# EAGLE design IoT_Shield (EAGLE 7.3.0)
Version 1.1
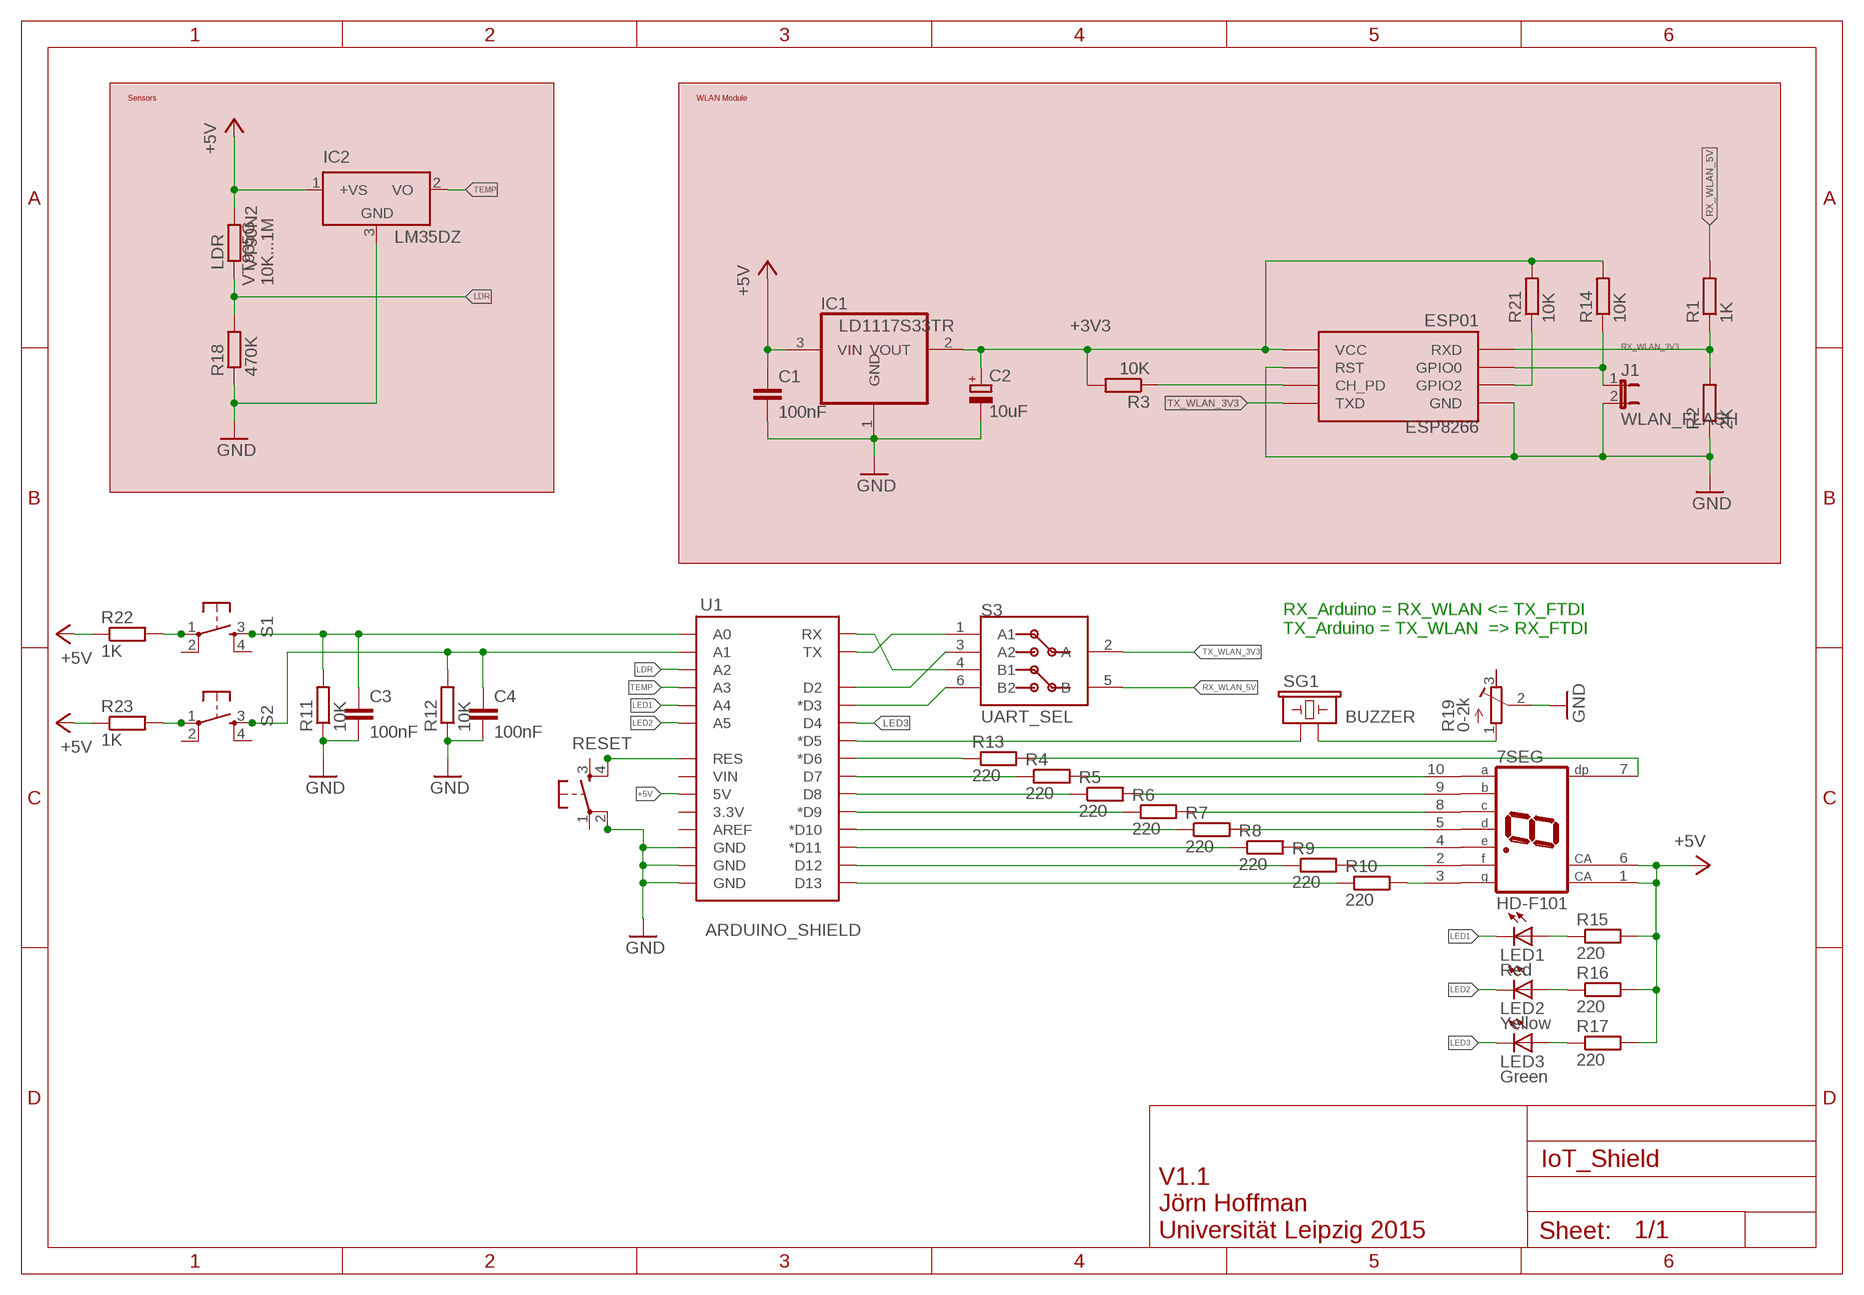
[diagram p0: schematic, sheet 1]

## Parts
7SEG  HD-F101  [HDSP-E]
C1  100nF  C-EUC0805  [C0805]
C2  10uF  CPOL-EUA/3216-18R  [A/3216-18R]
C3  100nF  C-EUC0805  [C0805]
C4  100nF  C-EUC0805  [C0805]
ESP8266  ESP01  [ESP01]
IC1  LD1117S33TR  REG1117  [SOT223]
IC2  LM35DZ  LM35CZ  [TO92]
J1  WLAN_FLASH  JP1E  [JP1]
LDR  VT90N2  R-EU_0204/2V  [0204V]
LED1  Red  LED5MM  [LED5MM]
LED2  Yellow  LED5MM  [LED5MM]
LED3  Green  LED5MM  [LED5MM]
R1  1K  R-EU_R0805  [R0805]
R2  2K  R-EU_R0805  [R0805]
R3  10K  R-EU_R0805  [R0805]
R4  220  R-EU_R0805  [R0805]
R5  220  R-EU_R0805  [R0805]
R6  220  R-EU_R0805  [R0805]
R7  220  R-EU_R0805  [R0805]
R8  220  R-EU_R0805  [R0805]
R9  220  R-EU_R0805  [R0805]
R10  220  R-EU_R0805  [R0805]
R11  10K  R-EU_R0805  [R0805]
R12  10K  R-EU_R0805  [R0805]
R13  220  R-EU_R0805  [R0805]
R14  10K  R-EU_R0805  [R0805]
R15  220  R-EU_R0805  [R0805]
R16  220  R-EU_R0805  [R0805]
R17  220  R-EU_R0805  [R0805]
R18  470K  R-EU_R0805  [R0805]
R19  0-2k  R-TRIMM4G/J  [RTRIM4G/J]
R21  10K  R-EU_R0805  [R0805]
R22  1K  R-EU_R0805  [R0805]
R23  1K  R-EU_R0805  [R0805]
RESET  TAC_SWITCHSMD  DTSM-6  [DTSM-6]
S1  TAC_SWITCHSMD  DTSM-6  [DTSM-6]
S2  TAC_SWITCHSMD  DTSM-6  [DTSM-6]
S3  UART_SEL  JS202011SCQN  [SMD]
SG1  BUZZER  BUZZERPTH  [BUZZER-12MM]
U1  ARDUINO_SHIELD  ARDUINO_SHIELDNO_SILK  [DUEMILANOVE_VIAS]

## Nets
+3V3: C2.+ ESP8266.VCC IC1.2(VOUT) R3.2 R14.2 R21.2
+5V: 7SEG.1(CA) 7SEG.6(CA) C1.1 IC1.3(VIN) IC2.1(+VS) LDR.2 R15.2 R16.2 R17.2 R22.1 R23.1 U1.5V
GND: C1.2 C2.- C3.2 C4.2 ESP8266.GND ESP8266.RST IC1.1(GND) IC2.3(GND) J1.2 R2.1 R11.1 R12.1 R18.1 R19.2(S) RESET.2 U1.GND@0(GND) U1.GND@1(GND) U1.GND@2(GND)
LDR: LDR.1 R18.2 U1.A2
LED1: LED1.K(C) U1.A4
LED2: LED2.K(C) U1.A5
LED3: LED3.K(C) U1.D4
N$1: ESP8266.CH_PD R3.1
N$2: R4.1 U1.D7
N$3: R5.1 U1.D8
N$4: R6.1 U1.D9(*D9)
N$5: R7.1 U1.D10(*D10)
N$6: R8.1 U1.D11(*D11)
N$7: R9.1 U1.D12
N$8: R10.1 U1.D13
N$9: 7SEG.10(A) R4.2
N$10: 7SEG.9(B) R5.2
N$11: 7SEG.8(C) R6.2
N$12: 7SEG.5(D) R7.2
N$13: 7SEG.4(E) R8.2
N$14: 7SEG.2(F) R9.2
N$15: 7SEG.3(G) R10.2
N$16: SG1.+ U1.D5(*D5)
N$17: C3.1 R11.2 S1.3 U1.A0
N$18: C4.1 R12.2 S2.3 U1.A1
N$19: 7SEG.7(DP) R13.2
N$21: R13.1 U1.D6(*D6)
N$22: S3.4(B1) U1.RX
N$23: S3.3(A2) U1.D2
N$24: S3.1(A1) U1.TX
N$25: S3.6(B2) U1.D3(*D3)
N$26: ESP8266.GPIO0 J1.1 R14.1
N$27: LED1.A R15.1
N$28: LED2.A R16.1
N$29: LED3.A R17.1
N$30: RESET.4 U1.RES
N$31: ESP8266.GPIO2 R21.1
N$32: R22.2 S1.1
N$33: R23.2 S2.1
N$34: R19.1(A) SG1.-
RX_WLAN_3V3: ESP8266.RX(RXD) R1.1 R2.2
RX_WLAN_5V: R1.2 S3.5(B)
TEMP: IC2.2(VO) U1.A3
TX_WLAN_3V3: ESP8266.TX(TXD) S3.2(A)
Unconnected: R19.3(E) RESET.1 RESET.3 S1.2 S1.4 S2.2 S2.4 U1.3.3V U1.AREF U1.VIN

## Notes on the sheet
- Sensors | WLAN Module
- VT935G
  10K...1M
- RX_Arduino = RX_WLAN <= TX_FTDI 
  TX_Arduino = TX_WLAN  => RX_FTDI
- V1.1
  Jörn Hoffman
  Universität Leipzig 2015

## Library data of the parts
7SEG = display-hp:HD-F101: LED DISPLAY 1-character 7 segment, decimal point right; OC_FARNELL: unknown; OC_NEWARK: unknown
C1 C3 C4 = rcl:C-EU: CAPACITOR, European symbol
C2 = rcl:CPOL-EU: POLARIZED CAPACITOR, European symbol
ESP8266 = esp8266modules:ESP01: ESP8266 Wifi module 01; OC_FARNELL: unknown
IC1 = burr-brown:REG1117: 800mA and 1A Low Dropout (LDO) Positive Regulator 1.8V, 2.5V, 2.85V, 3.3V, 5V, and Adj; MPN: REG1117; OC_FARNELL: 1097566; OC_NEWARK: 14P6981
IC2 = lm35:LM35: Single-Supply Centigrade Temperature Sensor Vout = (10mV/°C x Temp °C) +5mmmV Source: http://www.national.com/ds/LM/LM35.pdf
J1 = jumper:JP1E: JUMPER
LDR R1-R18 R21-R23 = rcl:R-EU_: RESISTOR, European symbol
LED1-LED3 = led:LED: LED OSRAM: - CHIPLED LG R971, LG N971, LY N971, LG Q971, LY Q971, LO R971, LY R971 LH N974, LH R974 LS Q976, LO Q976, LY Q976 LO Q996 - Hyper CHIPLED LW Q18S LB Q993, LB Q99A, LB R99A - SideLED LS A670, LO A670, LY A670, LG A670, LP A670 LB A673, LV A673, LT A673, LW A673 LH A674 LY A675 LS A676, LA A676, LO A676, LY A676, LW A676 LS A679, LY A679, LG A679 - Hyper Micro SIDELED® LS Y876, LA Y876, LO Y876, LY Y876 LT Y87S - SmartLED LW L88C, LW L88S LB L89C, LB L89S, LG L890 LS L89K, LO L89K, LY L89K LS L896, LA L896, LO L896, LY L896 - TOPLED LS T670, LO T670, LY T670, LG T670, LP T670 LSG T670, LSP T670, LSY T670, LOP T670, LYG T670 LG T671, LOG T671, LSG T671 LB T673, LV T673, LT T673, LW T673 LH T674 LS T676, LA T676, LO T676, LY T676, LB T676, LH T676, LSB T676, LW T676 LB T67C, LV T67C, LT T67C, LS T67K, LO T67K, LY T67K, LW E67C LS E67B, LA E67B, LO E67B, LY E67B, LB E67C, LV E67C, LT E67C LW T67C LS T679, LY T679, LG T679 LS T770, LO T770, LY T770, LG T770, LP T770 LB T773, LV T773, LT T773, LW T773 LH T774 LS E675, LA E675, LY E675, LS T675 LS T776, LA T776, LO T776, LY T776, LB T776 LHGB T686 LT T68C, LB T68C - Hyper Mini TOPLED® LB M676 - Mini TOPLED Santana® LG M470 LS M47K, LO M47K, LY M47K Source: http://www.osram.convergy.de LUXEON: - LUMILED® LXK2-PW12-R00, LXK2-PW12-S00, LXK2-PW14-U00, LXK2-PW14-V00 LXK2-PM12-R00, LXK2-PM12-S00, LXK2-PM14-U00 LXK2-PE12-Q00, LXK2-PE12-R00, LXK2-PE12-S00, LXK2-PE14-T00, LXK2-PE14-U00 LXK2-PB12-K00, LXK2-PB12-L00, LXK2-PB12-M00, LXK2-PB14-N00, LXK2-PB14-P00, LXK2-PB14-Q00 LXK2-PR12-L00, LXK2-PR12-M00, LXK2-PR14-Q00, LXK2-PR14-R00 LXK2-PD12-Q00, LXK2-PD12-R00, LXK2-PD12-S00 LXK2-PH12-R00, LXK2-PH12-S00 LXK2-PL12-P00, LXK2-PL12-Q00, LXK2-PL12-R00 Source: www.luxeon.com KINGBRIGHT: KA-3528ASYC Source: www.kingbright.com
R19 = rcl:R-TRIMM: Trimm resistor
RESET S1 S2 = switch-tact:DTSM-6
S3 = c&k_components:JS202011SCQN
SG1 = SparkFun-Electromechanical:BUZZER: Buzzer 12mm Spark Fun Electronics SKU : Comp-Buzzer
U1 = SparkFun-Boards:ARDUINO_SHIELD: Arduino shield footprint; OC_FARNELL: unknown

## Board
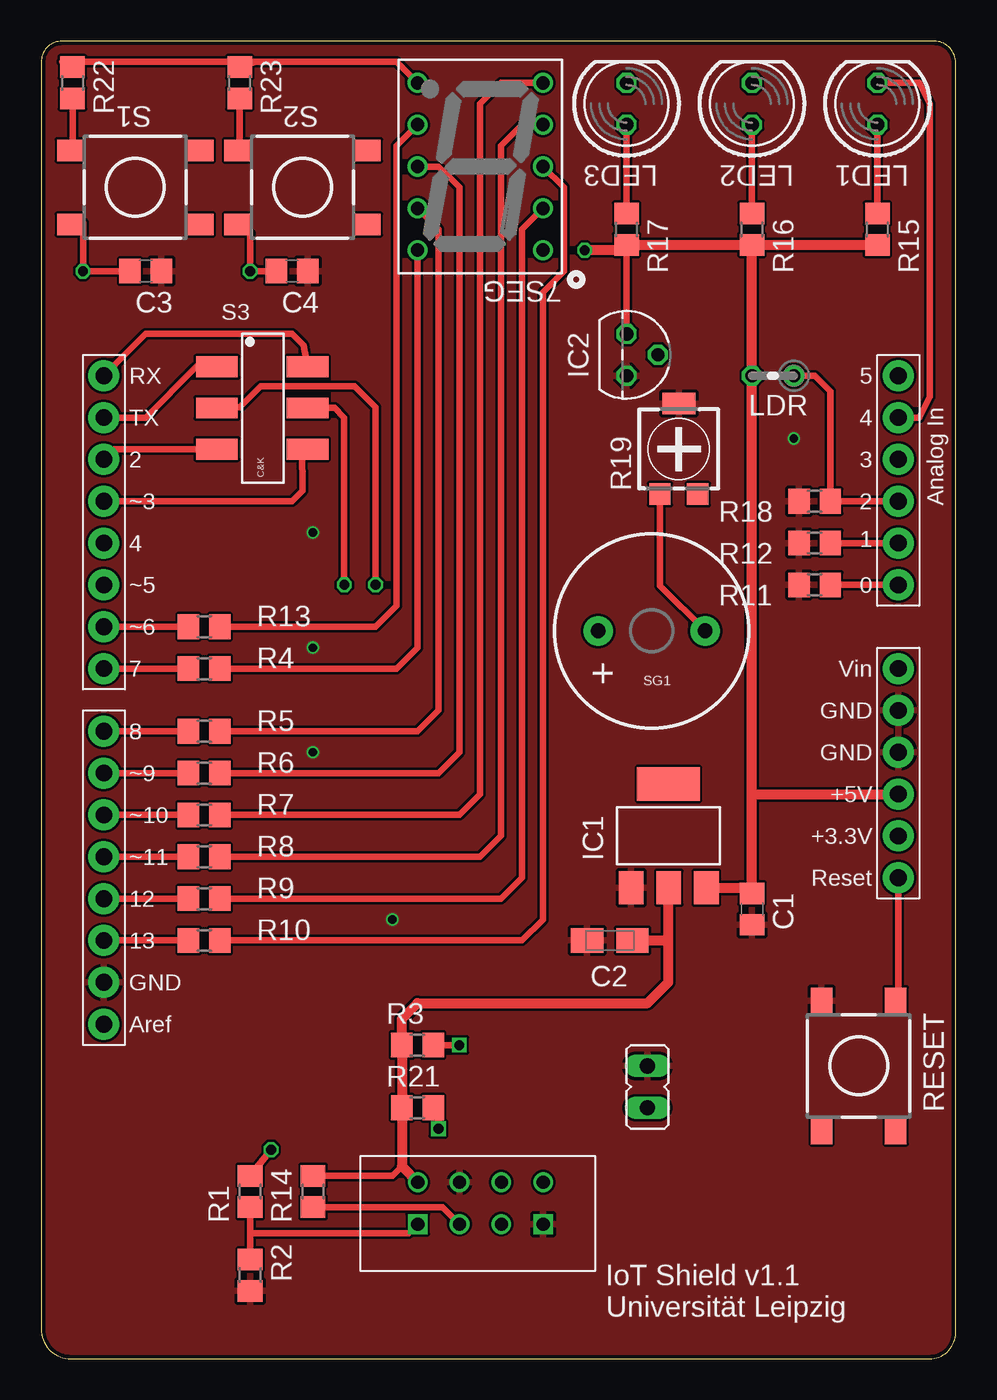
[diagram p1: board, top side]
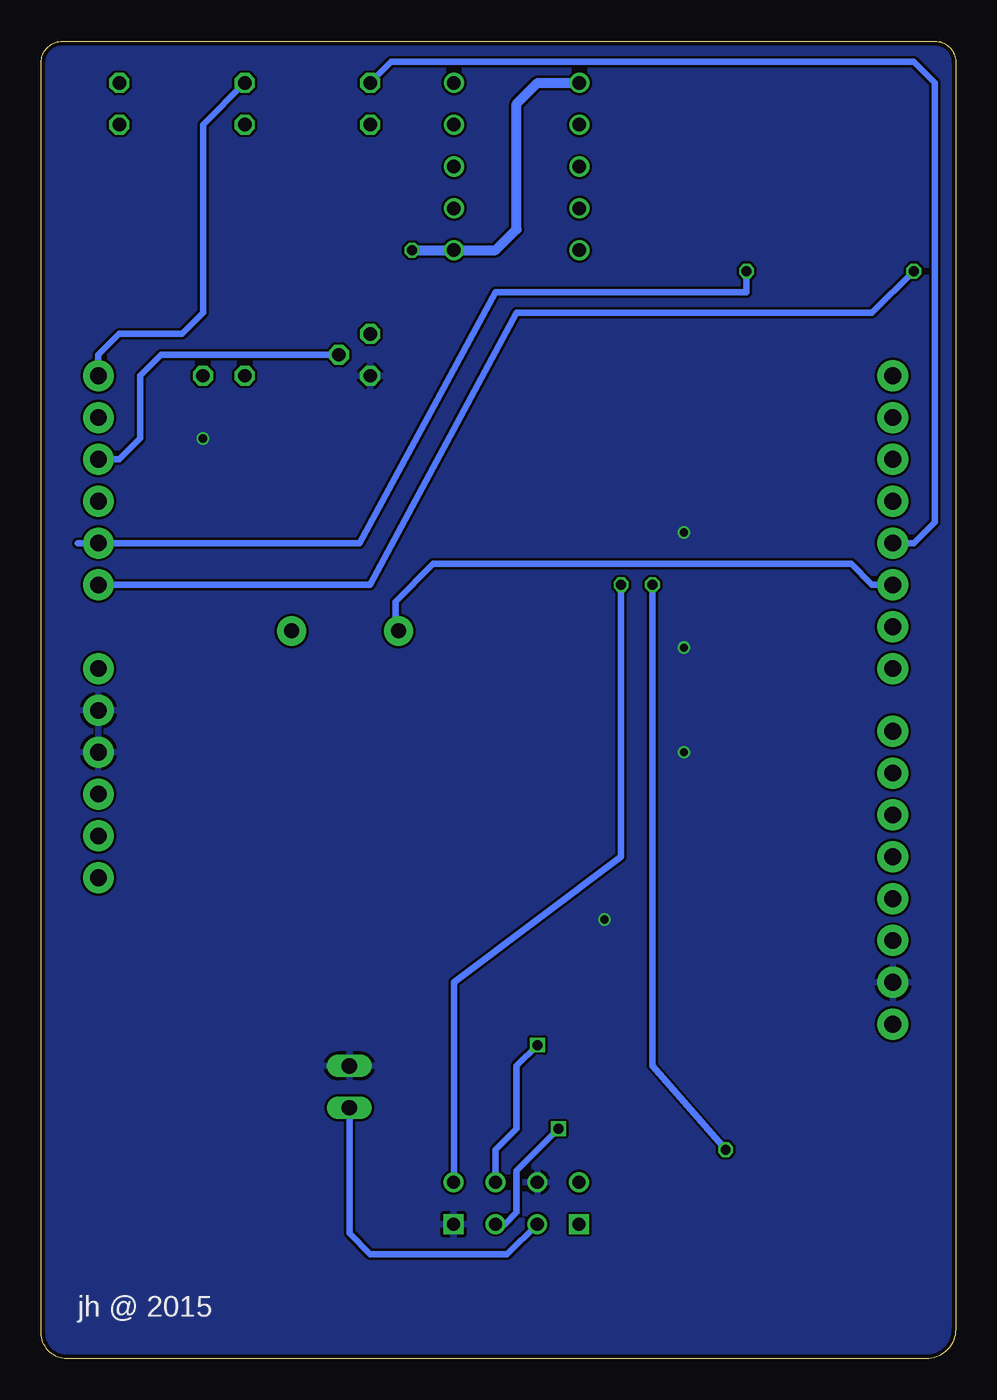
[diagram p2: board, bottom side, seen from below]

Size 55.55 x 80 mm. Coordinates in mm from the lower left corner, seen from the top.
Outline: 55.55,1.58 55.55,78.7 arc90 54.25,80 1.26,80 arc90 0,78.74 0,1.8 arc90 1.8,0 53.97,0 arc90 55.55,1.58
Copper layers (1*16): Top 0.018mm / dielectric 1.55mm / Bottom 0.018mm
Design rules "eC_2Layer_PClass6_BaseCopperO18_eCDefault": minimum track width 0.15mm, minimum drill 0.35mm, track to track 0.15mm, track to pad 0.15mm, pad to pad 0.15mm, via to via 0.15mm, smd to smd 0mil, copper to edge 0.25mm, drill to drill 0.35mm, minimum pad ring 0.175mm, minimum via ring 0.125mm, stop-mask expansion 0mil, vias tented up to drill 0.45mm, thermal gap 0.2mm

### Footprints (pad centres in the part's own frame; a part is rotated, then mirrored left to right if it is on the bottom)
HDSP-E = drill 0.813: 1 -3.81,5.08; 2 -3.81,2.54; 3 -3.81,0; 4 -3.81,-2.54; 5 -3.81,-5.08; 6 3.81,-5.08; 7 3.81,-2.54; 8 3.81,0; 9 3.81,2.54; 10 3.81,5.08
C0805 = smd 1.3 x 1.5: 1 -0.95,0; 2 0.95,0
A/3216-18R = smd 1.95 x 1.5: + 1.375,0; - -1.375,0
ESP01 = drill 0.8: CH_PD -1.285,-8.178; GPIO0 1.255,-5.638; GPIO2 -1.285,-5.638; RST 1.255,-8.178; TX -3.825,-8.178; VCC 3.795,-8.178 | drill 0.8 square: GND -3.825,-5.638; RX 3.795,-5.638
SOT223 = smd 1.499 x 2.007: 1 -2.261,-3.15; 2 0.025,-3.15; 3 2.311,-3.15 | smd 3.81 x 2.007: 4 0,3.15
TO92 = drill 0.813 octagon: 1 -1.27,0; 2 0,1.905; 3 1.27,0
JP1 = drill 0.914 long: 1 0,-1.27; 2 0,1.27
0204V = drill 0.813 octagon: 1 -1.27,0; 2 1.27,0
LED5MM = drill 0.813 octagon: A -1.27,0; K 1.27,0
R0805 = smd 1.3 x 1.5: 1 -0.95,0; 2 0.95,0
RTRIM4G/J = smd 1.3 x 1.3: 1 -1.15,-2.75; 3 1.15,-2.75 | smd 2 x 1.3: 2 0,2.75
DTSM-6 = smd 1.55 x 1.3: 1 -3.975,2.25; 2 3.975,2.25; 3 -3.975,-2.25; 4 3.975,-2.25
SMD = smd 1.27 x 2.54: 1 2,-0.75; 2 4.5,-0.75; 3 7,-0.75; 4 2,4.75; 5 4.5,4.75; 6 7,4.75
BUZZER-12MM = drill 0.9 pad 1.778: + 3.25,0; - -3.25,0
DUEMILANOVE_VIAS = drill 1.016 pad 1.88: 3.3V 50.8,13.97; 5V 50.8,16.51; A0 50.8,29.21; A1 50.8,31.75; A2 50.8,34.29; A3 50.8,36.83; A4 50.8,39.37; A5 50.8,41.91; AREF 2.54,2.54; D2 2.54,36.83; D3 2.54,34.29; D4 2.54,31.75; D5 2.54,29.21; D6 2.54,26.67; D7 2.54,24.13; D8 2.54,20.32; D9 2.54,17.78; D10 2.54,15.24; D11 2.54,12.7; D12 2.54,10.16; D13 2.54,7.62; GND@0 50.8,19.05; GND@1 50.8,21.59; GND@2 2.54,5.08; RES 50.8,11.43; RX 2.54,41.91; TX 2.54,39.37; VIN 50.8,24.13

### Placement (x,y rotation side)
7SEG  26.67,72.39 180 top
C1  43.18,27.3 270 top
C2  34.54,25.4 0 top
C3  6.35,66.04 0 top
C4  15.24,66.04 0 top
ESP8266  26.67,2.54 180 top
IC1  38.1,31.75 0 top
IC2  35.56,60.96 270 top
J1  36.83,16.51 0 top
LDR  44.45,59.69 180 top
LED1  50.8,76.2 90 top
LED2  43.18,76.2 90 top
LED3  35.56,76.2 90 top
R1  12.7,10.16 90 top
R2  12.7,5.08 90 top
R3  22.86,19.05 180 top
R4  9.91,41.91 0 top
R5  9.91,38.1 0 top
R6  9.91,35.56 0 top
R7  9.91,33.02 0 top
R8  9.91,30.48 0 top
R9  9.91,27.94 0 top
R10  9.91,25.4 0 top
R11  46.99,46.99 0 top
R12  46.99,49.53 0 top
R13  9.91,44.45 0 top
R14  16.51,10.16 90 top
R15  50.8,68.58 270 top
R16  43.18,68.58 270 top
R17  35.56,68.58 270 top
R18  46.99,52.07 0 top
R19  38.73,55.24 0 top
R21  22.86,15.24 180 top
R22  1.91,77.47 270 top
R23  12.06,77.47 270 top
RESET  49.66,17.78 90 top
S1  5.71,71.12 0 top
S2  15.88,71.12 0 top
S3  11.43,62.23 270 top
SG1  37.08,44.2 180 top
U1  1.27,17.78 0 top

### Tracks (layer width: path | path; a pad name or v marks a point on that pad's centre or on a via)
+3V3
  Top 0.406: R14.2 21.34,11.11 21.91,11.68 | 38.1,28.57 IC1.2
  Top 0.61: ESP8266.VCC 21.91,11.68 R21.2 R3.2 21.91,20.64 22.86,21.59 36.83,21.59 38.1,22.86 38.1,25.4 | 38.1,25.4 38.1,28.57 | C2.+ 38.1,25.4
+5V  (via drill 0.6)
  Top 0.406: R17.2 35.24,67.31 35.56,67.31 IC2.1 | R23.1 12.38,78.74 | R22.1 1.27,78.74 12.06,78.74 R23.1 | 13.02,78.74 R23.1 | 51.9,34.12 U1.5V | 7SEG.6 21.59,78.74 12.38,78.74 R23.1
  Top 0.61: R17.2 R16.2 | R16.2 R15.2 | 35.24,67.31 v33.02,67.31 | R16.2 LDR.2 43.18,34.29 | IC1.3 43.18,28.6 | C1.1 43.18,28.6 | 43.18,28.6 43.18,34.29 | 43.18,34.29 U1.5V | 2.23,78.74 R22.1
  Bottom 0.61: v33.02,67.31 7SEG.1 27.94,67.31 26.67,68.58 26.67,76.2 25.4,77.47 7SEG.6
GND  (via drill 0.5)
  other vias: 16.51,50.16 16.51,43.18 16.51,36.83 21.34,26.67 45.72,55.88
  pour Top: 35.56,34.29 35.56,36.83 40.64,36.83 40.64,34.29
  pour Bottom: 55.88,2.84 55.88,78.21 arc90 54.08,80.01 1.8,80.01 arc90 0,78.21 0,1.8 arc90 1.8,0 53.04,0 arc90
  pour Top: 55.88,2.91 55.88,78.21 arc90 54.08,80.01 1.8,80.01 arc90 0,78.21 0,1.8 arc90 1.8,0 52.97,0.07 arc91
LDR
  Top 0.406: U1.A2 R18.2 47.94,58.74 46.99,59.69 LDR.1
LED1
  Top 0.406: LED1.K 53.34,77.47 53.98,76.2 53.98,58.42 53.34,57.15 U1.A4
LED2
  Bottom 0.406: LED2.K 45.72,74.93 45.72,63.5 46.99,62.23 50.8,62.23 52.07,60.96 U1.A5
LED3
  Bottom 0.406: LED3.K 34.29,78.74 2.54,78.74 1.27,77.47 1.27,50.8 2.54,49.53 U1.D4
N$1  (via drill 0.6)
  Top 0.406: R3.1 v25.4,19.05
  Bottom 0.406: v25.4,19.05 26.67,17.78 26.67,13.97 27.95,12.69 ESP8266.CH_PD
N$2
  Top 0.406: R4.1 U1.D7
N$3
  Top 0.406: R5.1 U1.D8
N$4
  Top 0.406: R6.1 U1.D9
N$5
  Top 0.406: R7.1 U1.D10
N$6
  Top 0.406: R8.1 U1.D11
N$7
  Top 0.406: R9.1 U1.D12
N$8
  Top 0.406: R10.1 U1.D13
N$9
  Top 0.406: 7SEG.10 22.86,43.18 21.59,41.91 R4.2
N$10
  Top 0.406: 7SEG.9 24.13,68.58 24.13,39.37 22.86,38.1 R5.2
N$11
  Top 0.406: R6.2 24.13,35.56 25.4,36.83 25.4,71.12 24.13,72.39 7SEG.8
N$12
  Top 0.406: 7SEG.5 27.94,77.47 26.67,76.2 26.67,34.29 25.4,33.02 R7.2
N$13
  Top 0.406: 7SEG.4 29.21,74.93 27.94,73.66 27.94,31.75 26.67,30.48 R8.2
N$14
  Top 0.406: R9.2 27.94,27.94 29.21,29.21 29.21,68.58 7SEG.2
N$15
  Top 0.406: 7SEG.3 31.75,71.12 31.75,66.04 30.48,64.77 30.48,26.67 29.21,25.4 R10.2
N$16
  Bottom 0.406: U1.D5 5.08,46.99 6.35,48.26 31.75,48.26 34.04,45.97 34.04,44.2 SG1.+
N$17  (via drill 0.6)
  Top 0.406: U1.A0 R11.2 | S1.3 2.54,68.96 v2.54,66.04 C3.1
  Bottom 0.406: v2.54,66.04 5.08,63.5 26.67,63.5 35.56,46.99 U1.A0
N$18  (via drill 0.6)
  Top 0.406: U1.A1 R12.2 | S2.3 12.7,68.33 v12.7,66.04 C4.1
  Bottom 0.406: v12.7,66.04 12.7,64.77 27.94,64.77 36.2,49.53 U1.A1 53.34,49.53
N$19
  Top 0.406: 7SEG.7 21.59,73.66 21.59,45.72 20.32,44.45 R13.2
N$21
  Top 0.406: R13.1 U1.D6
N$22
  Top 0.406: U1.RX 6.35,62.23 15.24,62.23 15.93,61.54 S3.4
N$23
  Top 0.406: U1.D2 4.43,55.23 S3.3
N$24
  Top 0.406: U1.TX 6.35,57.15 9.43,60.23 S3.1
N$25
  Top 0.406: U1.D3 15.24,52.07 15.88,52.7 15.86,55.23 S3.6
N$26
  Top 0.406: R14.1 24.38,9.21 ESP8266.GPIO0
  Bottom 0.406: J1.1 36.83,7.62 35.56,6.35 27.24,6.35 ESP8266.GPIO0
N$27
  Top 0.406: LED1.A R15.1
N$28
  Top 0.406: LED2.A R16.1
N$29
  Top 0.406: LED3.A R17.1
N$30
  Top 0.406: U1.RES 52.07,21.92 RESET.4
N$31  (via drill 0.6)
  Top 0.406: R21.1 24.13,14.92 v24.13,13.97
  Bottom 0.406: v24.13,13.97 26.67,11.43 26.67,8.89 27.38,8.18 ESP8266.GPIO2
N$32
  Top 0.406: R22.2 1.91,73.37 S1.1
N$33
  Top 0.406: R23.2 12.06,73.37 S2.1
N$34
  Top 0.406: R19.1 37.59,46.95 SG1.-
RX_WLAN_3V3
  Top 0.406: 12.7,7.62 R2.2 | R1.1 12.7,7.62 | 12.7,7.62 22.32,7.62 ESP8266.RX
RX_WLAN_5V  (via drill 0.6)
  Top 0.406: v13.97,12.7 R1.2 | v18.41,46.99 18.41,57.15 17.84,57.73 S3.5
  Bottom 0.406: v18.41,46.99 18.41,17.78 v13.97,12.7
TEMP
  Bottom 0.406: IC2.2 48.26,60.96 49.53,59.69 49.53,55.88 50.8,54.61 U1.A3
TX_WLAN_3V3  (via drill 0.6)
  Top 0.406: v20.32,46.99 20.32,57.78 19.05,59.05 13.34,59.05 12.06,57.78 10.59,57.78 S3.2
  Bottom 0.406: v20.32,46.99 20.32,30.48 30.48,22.86 30.48,10.73 ESP8266.TX

### Text on the board
tPlace: +
tNames: IoT Shield v1.1 / Universität Leipzig
bNames: jh @ 2015